# Altium schematic sheet ESP32.SchDoc
size A4
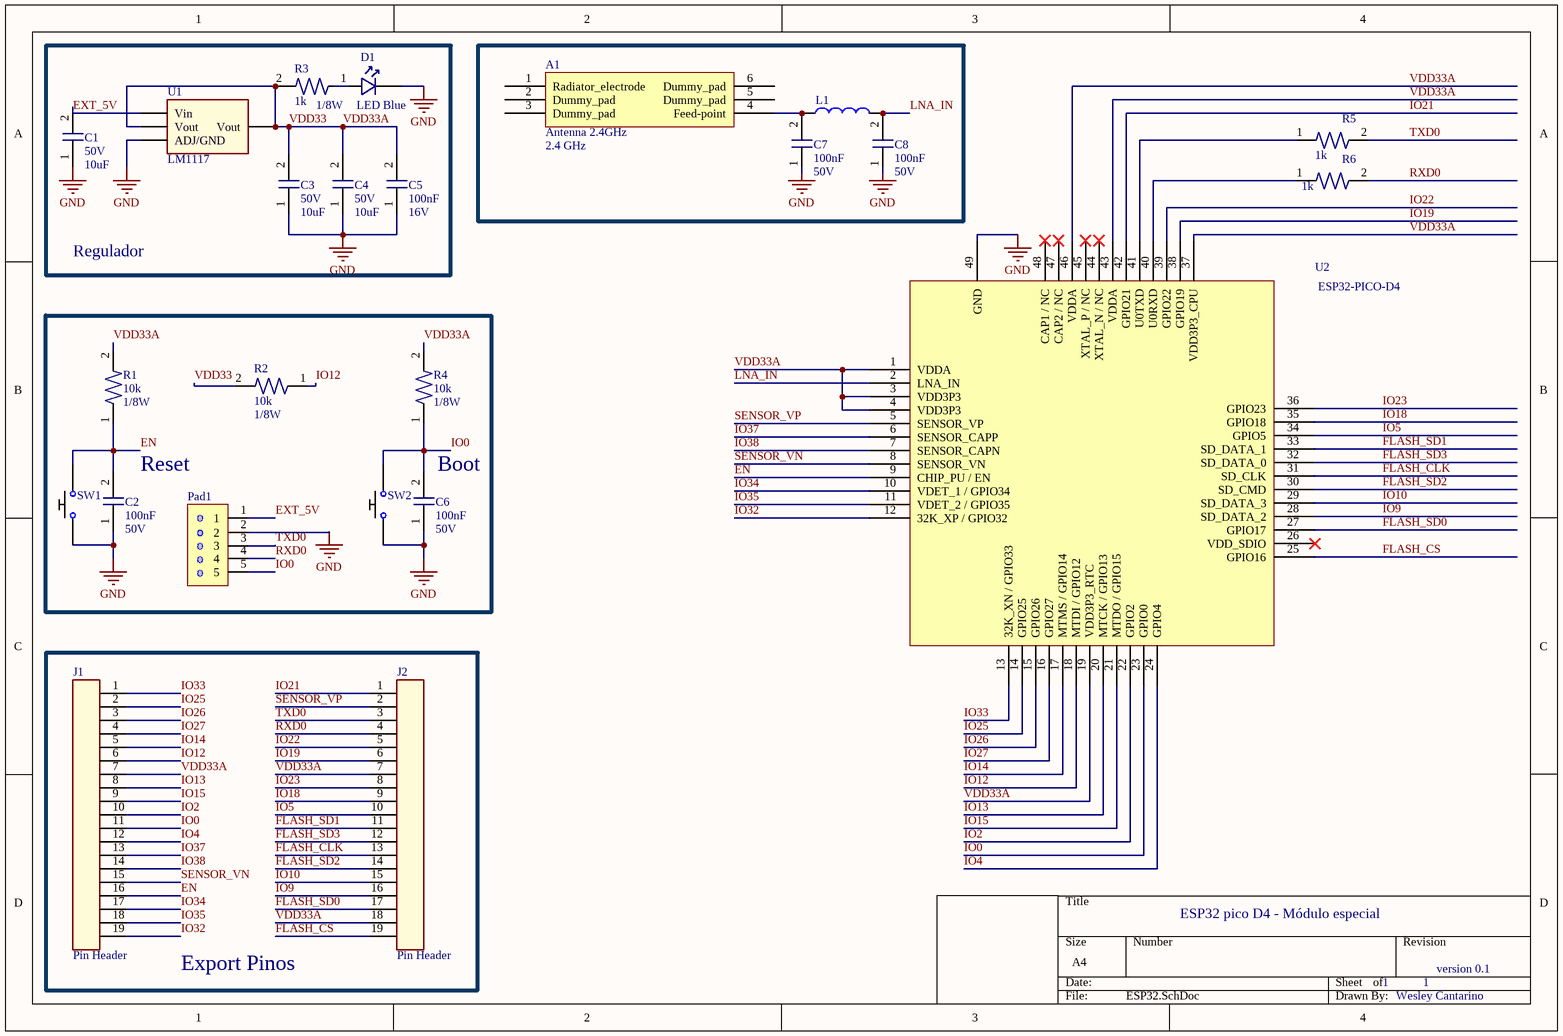
[diagram p0: ESP32.SchDoc]

## Parts
A1  Antenna 2.4GHz  Frequency Range: 2.4 GHz  [PCBComponent_1]
C1  Voltage: 50V  Capacitance: 10uF  [CAP 100nF/50V]  (hidden comment: CAP 10uF/50V)
C2  Capacitance: 100nF  Voltage: 50V  [CAP 10uF/6.3V]  (hidden comment: CAP 100nF/50V)
C3  Voltage: 50V  Capacitance: 10uF  [CAP 22uF/6.3V]  (hidden comment: CAP 10uF/50V)
C4  Voltage: 50V  Capacitance: 10uF  [RES SMD 62k OHM 1% 1/16W 0402]  (hidden comment: CAP 10uF/50V)
C5  Capacitance: 100nF  Voltage: 16V  [RES SMD 200k OHM 1% 1/16W 0402]  (hidden comment: CAP 100nF/16V)
C6  Capacitance: 100nF  Voltage: 50V  [CAP 22uF/6.3V]  (hidden comment: CAP 100nF/50V)
C7  Capacitance: 100nF  Voltage: 50V  [CAP 10uF/6.3V]  (hidden comment: CAP 100nF/50V)
C8  Capacitance: 100nF  Voltage: 50V  [CAP 10uF/6.3V]  (hidden comment: CAP 100nF/50V)
D1  LED Blue  [Model Name]
J1  Pin Header  [Pin Header 19 Ways]
J2  Pin Header  [Pin Header 19 Ways]
L1  LBEAD  [CAP 10uF/6.3V]  (value not drawn)
Pad1  CN_KK_5  [CN_KK_5_5045-5]  (value not drawn)
R1  Resistence: 10k  Power: 1/8W  [RES SMD 0 OHM 1/16W 0402]  (hidden comment: RES 0603)
R2  Resistence: 10k  Power: 1/8W  [RES SMD 0 OHM 1/16W 0402]  (hidden comment: RES 0603)
R3  Resistence: 1k  Power: 1/8W  [RES SMD 430 OHM 1% 1/16W 0402]  (hidden comment: RES 0603)
R4  Resistence: 10k  Power: 1/8W  [RES SMD 0 OHM 1/16W 0402]  (hidden comment: RES 0603)
R5  Resistence: 1k  [RES SMD 0 OHM 1/16W 0402]  (hidden comment: RES 0603)
R6  Resistence: 1k  [RES SMD 0 OHM 1/16W 0402]  (hidden comment: RES 0603)
SW1  Tactile Switch SPST 5.10X0.40 mm  [PCBComponent_1]  (value not drawn)
SW2  Tactile Switch SPST 5.10X0.40 mm  [PCBComponent_1]  (value not drawn)
U1  LM1117  [LM1117]
U2  ESP32-PICO-D4  [*PQFN50P700X700X104-49N]

## Blocks framed on the sheet
Regulador: C1 C3-C5 D1 R3 U1
Export Pinos: J1 J2

## Nets
GND: C1.1 C2.1 C3.1 C4.1 C5.1 C6.1 C7.1 C8.1 D1.K Pad1.2 SW1.1(A) SW2.1(A) U1.1(ADJ/GND) U2.49(GND)
EN: C2.2 J1.16 R1.1 SW1.2(B) U2.9(CHIP_PU_/_EN)
EXT_5V: C1.2 Pad1.1 U1.3(Vin)
FLASH_CLK: J2.13 U2.31(SD_CLK)
FLASH_CS: J2.19 U2.25(GPIO16)
FLASH_SD0: J2.17 U2.27(GPIO17)
FLASH_SD1: J2.11 U2.33(SD_DATA_1)
FLASH_SD2: J2.14 U2.30(SD_CMD)
FLASH_SD3: J2.12 U2.32(SD_DATA_0)
IO0: C6.2 J1.11 Pad1.5 R4.1 SW2.2(B) U2.23(GPIO0)
IO2: J1.10 U2.22(GPIO2)
IO4: J1.12 U2.24(GPIO4)
IO5: J2.10 U2.34(GPIO5)
IO9: J2.16 U2.28(SD_DATA_2)
IO10: J2.15 U2.29(SD_DATA_3)
IO12: J1.6 R2.1 U2.18(MTDI_/_GPIO12)
IO13: J1.8 U2.20(MTCK_/_GPIO13)
IO14: J1.5 U2.17(MTMS_/_GPIO14)
IO15: J1.9 U2.21(MTDO_/_GPIO15)
IO18: J2.9 U2.35(GPIO18)
IO19: J2.6 U2.38(GPIO19)
IO21: J2.1 U2.42(GPIO21)
IO22: J2.5 U2.39(GPIO22)
IO23: J2.8 U2.36(GPIO23)
IO25: J1.2 U2.14(GPIO25)
IO26: J1.3 U2.15(GPIO26)
IO27: J1.4 U2.16(GPIO27)
IO32: J1.19 U2.12(32K_XP_/_GPIO32)
IO33: J1.1 U2.13(32K_XN_/_GPIO33)
IO34: J1.17 U2.10(VDET_1_/_GPIO34)
IO35: J1.18 U2.11(VDET_2_/_GPIO35)
IO37: J1.13 U2.6(SENSOR_CAPP)
IO38: J1.14 U2.7(SENSOR_CAPN)
LNA_IN: C8.2 L1.2 U2.2(LNA_IN)
RXD0: J2.4 Pad1.4 R6.2
SENSOR_VN: J1.15 U2.8(SENSOR_VN)
SENSOR_VP: J2.2 U2.5(SENSOR_VP)
TXD0: J2.3 Pad1.3 R5.2
VDD33: C3.2 C4.2 C5.2 J1.7 J2.7 J2.18 R1.2 R2.2 R3.2 R4.2 U1.2(Vout) U1.4(Vout) U2.1(VDDA) U2.3(VDD3P3) U2.4(VDD3P3) U2.19(VDD3P3_RTC) U2.37(VDD3P3_CPU) U2.43(VDDA) U2.46(VDDA)  [also labelled VDD33A]
NetA1_4: A1.4(Feed-point) C7.2 L1.1
NetD1_A: D1.A R3.1
NetR5_1: R5.1 U2.41(U0TXD)
NetR6_1: R6.1 U2.40(U0RXD)

Not connected (* = marked no-connect by the designer): A1 1(Radiator_electrode) 2(Dummy_pad) 3(Dummy_pad) 5(Dummy_pad) 6(Dummy_pad); U2 26(VDD_SDIO)* 44(XTAL_N_/_NC)* 45(XTAL_P_/_NC)* 47(CAP2_/_NC)* 48(CAP1_/_NC)*

## Notes on the sheet
- Reset
- (near C6) Boot
- ESP32 pico D4 - Módulo especial
- 1
- version 0.1
- Wesley Cantarino

## Library data of the parts
A1 = Antenna 2.4GHz: SMD Antennas RoHS; Manufacturer: TDK; Mfr.Part #: ANT016008LCS2442MA2; ComponentLink1Description: Datasheet; ComponentLink1URL: https://datasheet.lcsc.com/szlcsc/1809131538_TDK-ANT016008LCS2442MA2_C209892.pdf; LCSC Part #: C209892
C1 C3 C4 = CAP  10uF/50V: 10uF ±1% 50V Ceramic Capacitor C0G, NP0 0805 (2012 Metric); Manufacturer 1: Murata Electronics North America; Manufacturer 1 PN: GRM2165C1H102FA01D; Digikey PN: 490-6441-1-ND; Mouser PN: 81-GRM2165C1H102FA01; ComponentLink1Description: Datasheet; ComponentLink1URL: https://www.murata.com/~/media/webrenewal/support/library/catalog/products/capacitor/mlcc/c02e.ashx?la=en-us
C2 C6-C8 = CAP 100nF/50V: 0.1µF ±10% 50V Ceramic Capacitor X5R 0402 (1005 Metric); Manufacturer 1: Yageo; Manufacturer 1 PN: CC0402KRX5R9BB104; Digikey PN: 311-3342-1-ND; ComponentLink1Description: Datasheet; ComponentLink1URL: https://search.murata.co.jp/Ceramy/image/img/A01X/G101/ENG/GRM022R60J103KE19-01.pdf
C5 = CAP 100nF/16V: 0.1µF ±20% 16V Ceramic Capacitor Y5V (F) 0805 (2012 Metric); Manufacturer 1: Samsung Electro-Mechanics; Manufacturer 1 PN: CL21A106KOQNNWE; Mouser PN: 581-08055C104K4Z4A; Digikey PN: 1276-2894-1-ND; ComponentLink1Description: Specifications; ComponentLink1URL: http://www.samsungsem.com/kr/support/product-search/mlcc/__icsFiles/afieldfile/2018/07/27/CL21A106KOQNNWE.pdf
D1 = LED Blue: Blue 470nm LED Indication - Discrete 3.3V 0805 (2012 Metric); pin to pad: A>1 K>2; Manufacturer 1: Lite-On Inc.; Manufacturer 1 PN: LTST-C171TBKT
J1 J2 = Pin Header 19 ways: Connector Header PTH 0.100" (2.54mm); Manufacturer 1: Irwin Inc.; Manufacturer 1 PN: M20-9992046
L1 = IND_LBEAD_SMD_1806: Inductor LBEAD; Value: LBEAD
Pad1 = CN_KK_5: KK_5; Value: ?
R1-R6 = RES 10k 1% 1/8W: 10 kOhms ±1% 0.125W, 1/8W Chip Resistor 0603 (1608 Metric) Anti-Sulfur, Moisture Resistant Thin Film; Manufacturer 1: Stackpole Electronics Inc.; Manufacturer 1 PN: RNCP0603FTD10K0; Digikey PN: RNCP0603FTD10K0CT-ND; ComponentLink1Description: Datasheet; ComponentLink1URL: http://www.yageo.com/documents/recent/PYu-RC_Group_51_RoHS_L_9.pdf; Mouser PN: 755-ESR03EZPF1002
  R5 R6: Power: 1/8W
SW1 SW2 = Tactile Switch SPST 5.10X0.40 mm: TACTILE SWITCHES SPST 5.10MM X 5.10MM 0.40MM 50MA @ 12VDC SMD ROHS; Manufacturer: XKB Enterprise; MFR.Part #: TS-1187A-B-A-B; LCSC Part #: C318884; Package: SMD-SW-4_5.1x5.1x1.5; Voltage: 12 VDC; Current: 50 mA
U1 = LM1117: Linear Voltage Regulator IC Positive Fixed 1 Output 3.3V 1A SOT-223; Manufacturer 1: Diodes Incorporated; Manufacturer 1 PN: AZ1117EH-3.3TRG1; Manufacturer 2 PN: LD1117S33TR; Notes: Every PMIC named 1117 is the same; Manufacturer 2: STMicroelectronics; Digikey PN: AZ1117EH-3.3TRG1DICT-ND; Mouser PN: 621-AZ1117EH-3.3TRG1; ComponentLink1Description: Datasheet; ComponentLink1URL: https://www.diodes.com/assets/Datasheets/AZ1117E.pdf
U2 = ESP32-PICO-D4: RF TRANSCEIVER ICS QFN-48_7X7X05P ROHS; Manufacturer: Espressif Systems; ComponentLink1Description: Datasheet; ComponentLink1URL: https://datasheet.lcsc.com/szlcsc/Espressif-Systems-ESP32-PICO-D4_C193707.pdf; ComponentLink2Description: Datasheet_EN; ComponentLink2URL: https://www.espressif.com/sites/default/files/documentation/esp32-pico-d4_datasheet_en.pdf; MFR.Part #: ESP32-PICO-D4; LCSC Part #: C193707; Package: QFN-48_EP_7.0x7.0x0.5P